# Altium schematic sheet SH14 - BOOT MODE.SchDoc
size 386 x 246 mm
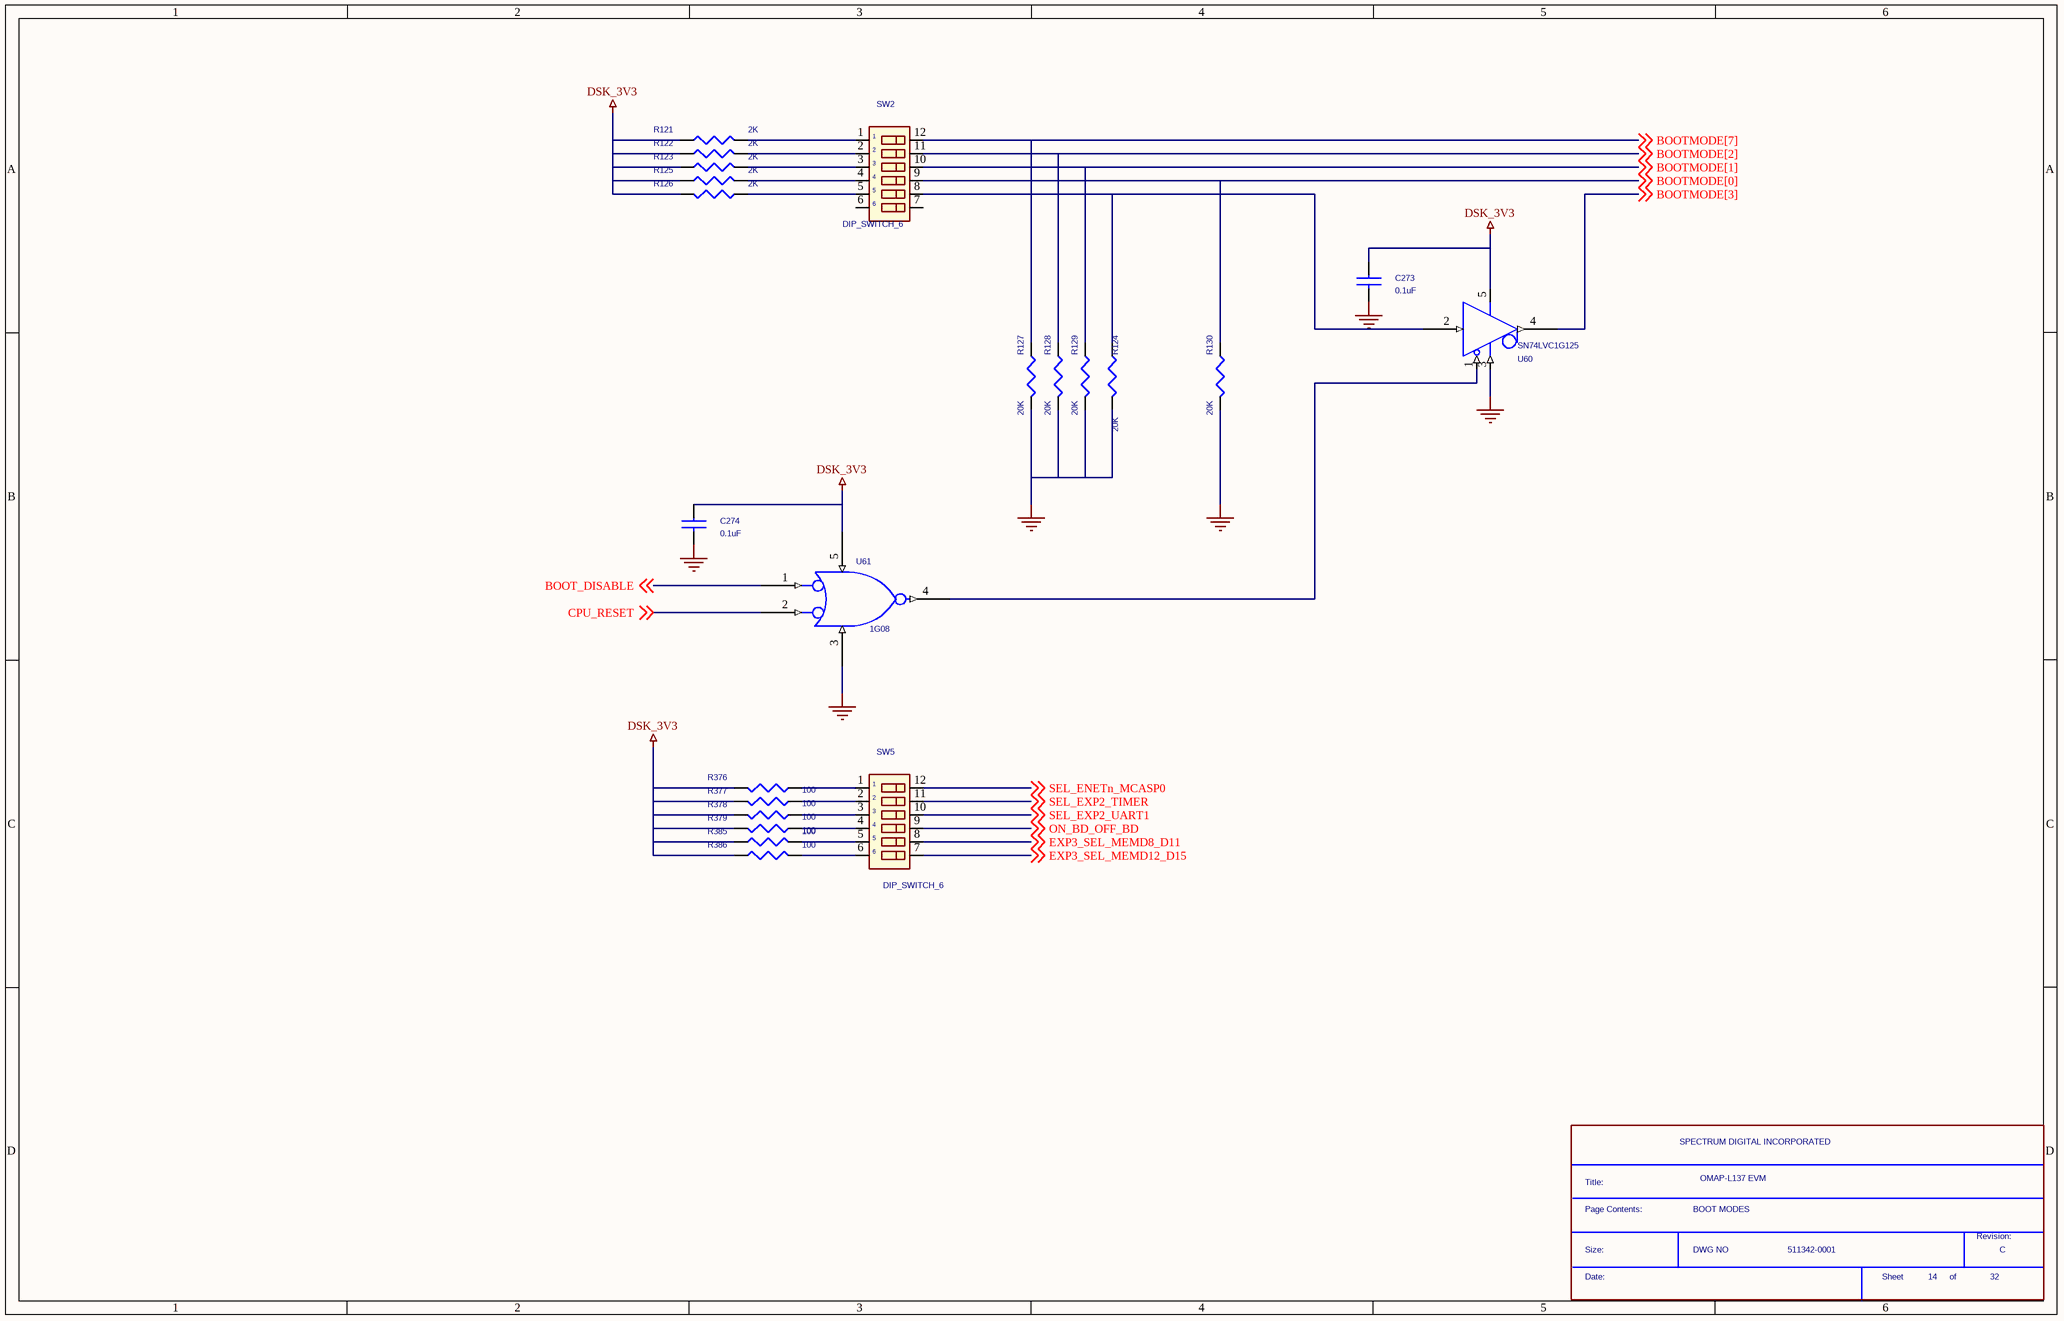
[diagram p0: SH14 - BOOT MODE.SchDoc]

## Parts
*  Page Contents:: BOOT MODES  RevCode: C  Title: OMAP-L137 EVM  OrgName: SPECTRUM DIGITAL INCORPORATED  Doc: 511342-0001  Page Number: 14  Page Count: 32  (hidden comment: SDTitleBlock)  (graphical)
C273  0.1uF  [c402-25]
C274  0.1uF  [c402-25]
R121  2K  [r402-25]
R122  2K  [r402-25]
R123  2K  [r402-25]
R124  20K  [r402-25]
R125  2K  [r402-25]
R126  2K  [r402-25]
R127  20K  [r402-25]
R128  20K  [r402-25]
R129  20K  [r402-25]
R130  20K  [r402-25]
R376  100  [r402-25]
R377  100  [r402-25]
R378  100  [r402-25]
R379  100  [r402-25]
R385  100  [r402-25]
R386  100  [r402-25]
SW2  DIP_SWITCH_6  [DIP_SWITCH_10]
SW5  DIP_SWITCH_6  [DIP_SWITCH_10]
U60  SN74LVC1G125  [DCK]
U61  1G08  [SO5]

## Nets
DSK_3V3: C273.1 C274.1 R121.1 R122.1 R123.1 R125.1 R126.2 R376.1 R377.1 R378.1 R379.1 R385.1 R386.1 U60.5(VCC) U61.5(VCC)
GND: C273.2 C274.2 R124.1 R127.2 R128.2 R129.2 R130.2 U60.3(GND) U61.3(GND)
BOOT_DISABLE: U61.1(B) ; off-sheet BOOT_DISABLE
BOOTMODE[0]: R130.1 SW2.9 ; off-sheet BOOTMODE[0]
BOOTMODE[1]: R129.1 SW2.10 ; off-sheet BOOTMODE[1]
BOOTMODE[2]: R128.1 SW2.11 ; off-sheet BOOTMODE[2]
BOOTMODE[3]: U60.4(O) ; off-sheet BOOTMODE[3]
BOOTMODE[7]: R127.1 SW2.12 ; off-sheet BOOTMODE[7]
CPU_RESET: U61.2(A) ; off-sheet CPU_RESET
EXP3_SEL_MEMD8_D11: SW5.8 ; off-sheet EXP3_SEL_MEMD8_D11
EXP3_SEL_MEMD12_D15: SW5.7 ; off-sheet EXP3_SEL_MEMD12_D15
ON_BD_OFF_BD: SW5.9 ; off-sheet ON_BD_OFF_BD
SEL_ENETn_MCASP0: SW5.12 ; off-sheet SEL_ENETn_MCASP0
SEL_EXP2_TIMER: SW5.11 ; off-sheet SEL_EXP2_TIMER
SEL_EXP2_UART1: SW5.10 ; off-sheet SEL_EXP2_UART1
NetR121_2: R121.2 SW2.1
NetR122_2: R122.2 SW2.2
NetR123_2: R123.2 SW2.3
NetR124_2: R124.2 SW2.8 U60.2(I)
NetR125_2: R125.2 SW2.4
NetR126_1: R126.1 SW2.5
NetR376_2: R376.2 SW5.1
NetR377_2: R377.2 SW5.2
NetR378_2: R378.2 SW5.3
NetR379_2: R379.2 SW5.4
NetR385_2: R385.2 SW5.5
NetR386_2: R386.2 SW5.6
NetU60_1: U60.1(OE) U61.4(Y)

Not connected (* = marked no-connect by the designer): SW2 6 7

## Notes on the sheet
- (in symbol SDTitleBlock) Title:; Page Contents:; Revision:; Size:; DWG NO; Date:; Sheet; of

## Library data of the parts
C273 = CAP NP
C274 = CAP NP_0
R121-R123 R125 R126 = R_1: Part #: 101370-2002R
R124 R127-R130 = R_1: Part #: 101370-2003R
R376-R379 R385 R386 = R: Part #: 101370-1001R
SW2 SW5 = DIP_SWITCH_0: Part #: 101184-0006R